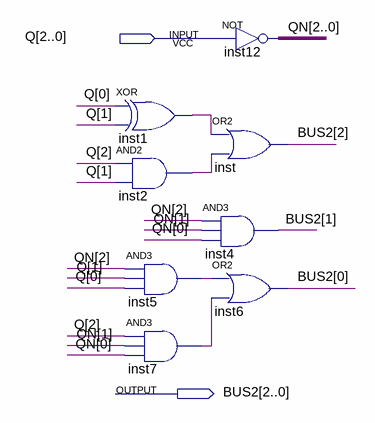
[diagram p0: schematic sheet]
// Quartus schematic BUS2.bdf as structural Verilog: 8 symbols, 2 pins
module BUS2 (
  input  [2:0] Q,
  output [2:0] BUS2
);

  wire inst1_out, inst2_out, inst5_out, inst7_out;
  wire [2:0] QN;

  xor inst1 (inst1_out, Q[0], Q[1]);
  and inst2 (inst2_out, Q[2], Q[1]);
  and inst5 (inst5_out, QN[2], Q[1], Q[0]);
  and inst7 (inst7_out, Q[2], QN[1], QN[0]);
  assign QN = ~Q;  // NOT inst12, 3 bits wide
  or inst (BUS2[2], inst1_out, inst2_out);
  and inst4 (BUS2[1], QN[2], QN[1], QN[0]);
  or inst6 (BUS2[0], inst5_out, inst7_out);
endmodule
